# Altium schematic sheet Artix7_SRAM.SchDoc
size A3; SheetNumber: 7; SheetTotal: 14
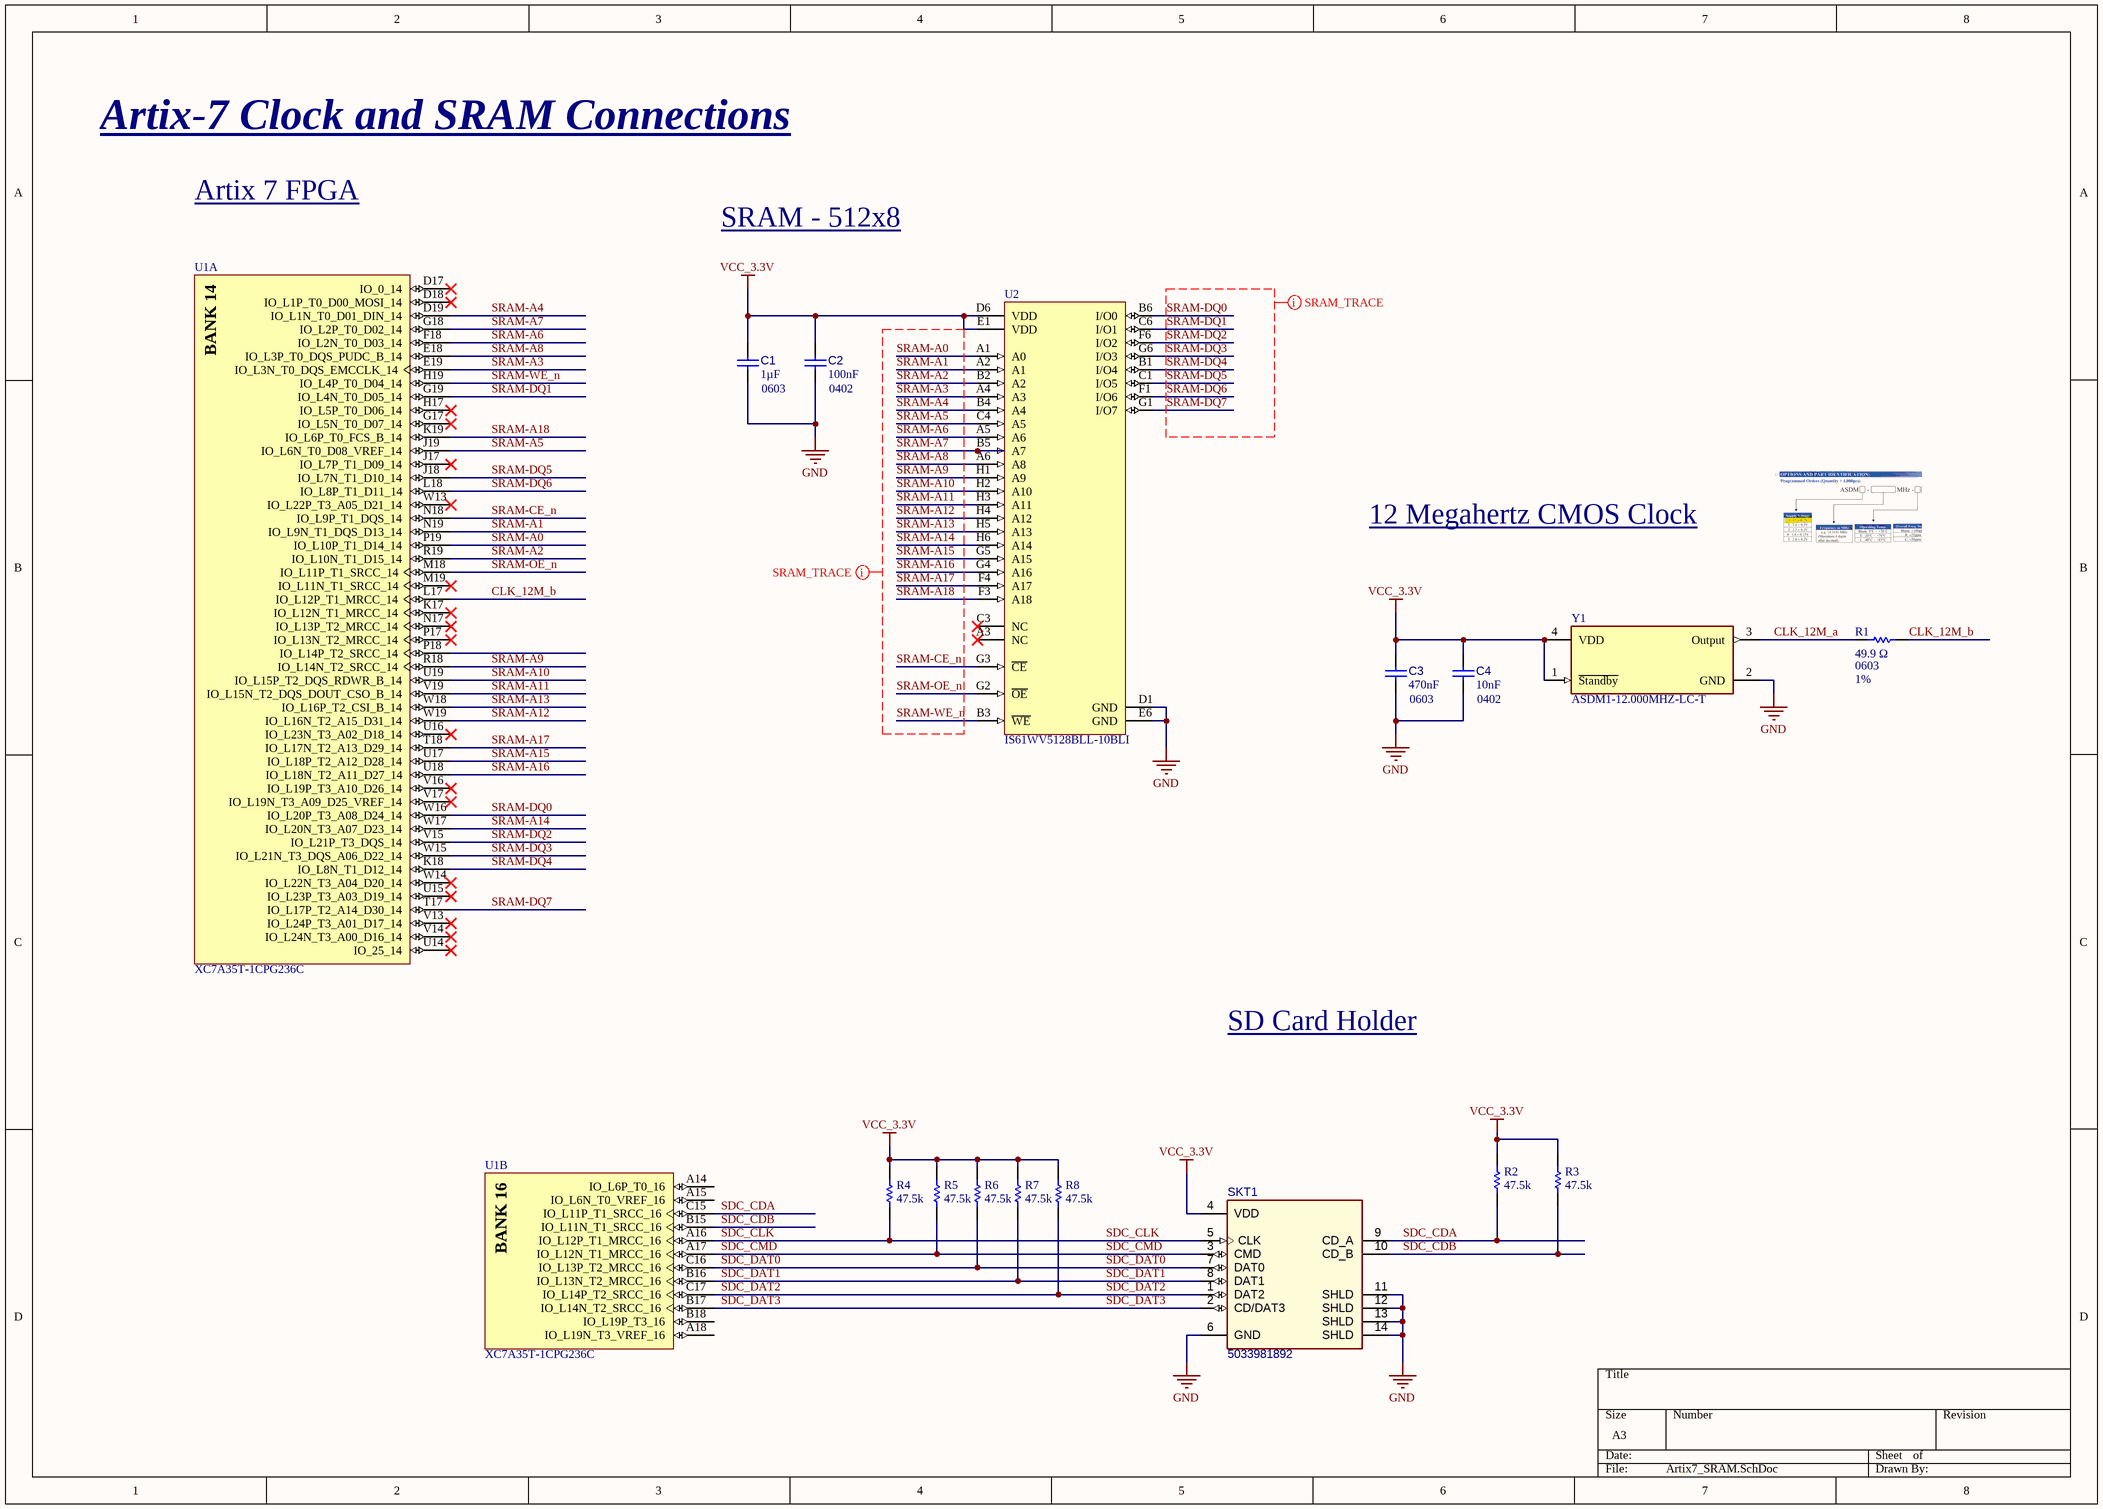
[diagram p0: Artix7_SRAM.SchDoc]

## Parts
C1  value 1µF  Case/Package: 0603  [CAPC0603(1608)100_L]  (hidden comment: Capacitor 1µF +/-0.1% 25V 0603)
C2  value 100nF  Case/Package: 0402  [CAPC0402(1005)60_L]  (hidden comment: Capacitor 100nF +/-20% 25V 0402)
C3  value 470nF  Case/Package: 0603  [CAPC0603(1608)100_L]  (hidden comment: Capacitor 470nF +/-20% 25V 0603)
C4  value 10nF  Case/Package: 0402  [CAPC0402(1005)60_L]  (hidden comment: Capacitor 10nF +/-20% 50V 0402)
R1  value 49.9 Ω  PackageReference: 0603  Tolerance: 1%  [RESC1608X55X25NL10T15]  (hidden comment: RC0603FR-0749R9L)
R2  value 47.5k  [RESC0402(1005)_L]  (hidden comment: 47D5KR2F)
R3  value 47.5k  [RESC0402(1005)_L]  (hidden comment: 47D5KR2F)
R4  value 47.5k  [RESC0402(1005)_L]  (hidden comment: 47D5KR2F)
R5  value 47.5k  [RESC0402(1005)_L]  (hidden comment: 47D5KR2F)
R6  value 47.5k  [RESC0402(1005)_L]  (hidden comment: 47D5KR2F)
R7  value 47.5k  [RESC0402(1005)_L]  (hidden comment: 47D5KR2F)
R8  value 47.5k  [RESC0402(1005)_L]  (hidden comment: 47D5KR2F)
SKT1  5033981892  [MOLX-5033981892_V]
U1  XC7A35T-1CPG236C  [CPG236]  (parts A,B of 10)
U2  IS61WV5128BLL-10BLI  [FP-IS61WV5128BLL-10BLI-IPC_A]
Y1  ASDM1-12.000MHZ-LC-T  [FP-ASDM-ASDMB-MFG]

## Nets
GND: C1.1 C2.1 C3.1 C4.2 SKT1.6(GND) SKT1.11(SHLD) SKT1.12(SHLD) SKT1.13(SHLD) SKT1.14(SHLD) U2.D1(GND) U2.E6(GND) Y1.2(GND)
VCC_3.3V: C1.2 C2.2 C3.2 C4.1 R2.2 R3.2 R4.2 R5.2 R6.2 R7.2 R8.2 SKT1.4(VDD) U2.D6(VDD) U2.E1(VDD) Y1.1(~{Standby}) Y1.4(VDD)
CLK_12M_a: R1.1 Y1.3(Output)
CLK_12M_b: R1.2 U1.L17(IO_L12P_T1_MRCC_14)
SDC_CDA: R2.1 SKT1.9(CD_A) U1.C15(IO_L11P_T1_SRCC_16)
SDC_CDB: R3.1 SKT1.10(CD_B) U1.B15(IO_L11N_T1_SRCC_16)
SDC_CLK: R4.1 SKT1.5(CLK) U1.A16(IO_L12P_T1_MRCC_16)
SDC_CMD: R5.1 SKT1.3(CMD) U1.A17(IO_L12N_T1_MRCC_16)
SDC_DAT0: R6.1 SKT1.7(DAT0) U1.C16(IO_L13P_T2_MRCC_16)
SDC_DAT1: R7.1 SKT1.8(DAT1) U1.B16(IO_L13N_T2_MRCC_16)
SDC_DAT2: R8.1 SKT1.1(DAT2) U1.C17(IO_L14P_T2_SRCC_16)
SDC_DAT3: SKT1.2(CD/DAT3) U1.B17(IO_L14N_T2_SRCC_16)
SRAM-A0: U1.P19(IO_L10P_T1_D14_14) U2.A1(A0)
SRAM-A1: U1.N19(IO_L9N_T1_DQS_D13_14) U2.A2(A1)
SRAM-A2: U1.R19(IO_L10N_T1_D15_14) U2.B2(A2)
SRAM-A3: U1.E19(IO_L3N_T0_DQS_EMCCLK_14) U2.A4(A3)
SRAM-A4: U1.D19(IO_L1N_T0_D01_DIN_14) U2.B4(A4)
SRAM-A5: U1.J19(IO_L6N_T0_D08_VREF_14) U2.C4(A5)
SRAM-A6: U1.F18(IO_L2N_T0_D03_14) U2.A5(A6)
SRAM-A7: U1.G18(IO_L2P_T0_D02_14) U2.B5(A7)
SRAM-A8: U1.E18(IO_L3P_T0_DQS_PUDC_B_14) U2.A6(A8)
SRAM-A9: U1.R18(IO_L14N_T2_SRCC_14) U2.H1(A9)
SRAM-A10: U1.U19(IO_L15P_T2_DQS_RDWR_B_14) U2.H2(A10)
SRAM-A11: U1.V19(IO_L15N_T2_DQS_DOUT_CSO_B_14) U2.H3(A11)
SRAM-A12: U1.W19(IO_L16N_T2_A15_D31_14) U2.H4(A12)
SRAM-A13: U1.W18(IO_L16P_T2_CSI_B_14) U2.H5(A13)
SRAM-A14: U1.W17(IO_L20N_T3_A07_D23_14) U2.H6(A14)
SRAM-A15: U1.U17(IO_L18P_T2_A12_D28_14) U2.G5(A15)
SRAM-A16: U1.U18(IO_L18N_T2_A11_D27_14) U2.G4(A16)
SRAM-A17: U1.T18(IO_L17N_T2_A13_D29_14) U2.F4(A17)
SRAM-A18: U1.K19(IO_L6P_T0_FCS_B_14) U2.F3(A18)
SRAM-CE_n: U1.N18(IO_L9P_T1_DQS_14) U2.G3(~{CE})
SRAM-DQ0: U1.W16(IO_L20P_T3_A08_D24_14) U2.B6(I/O0)
SRAM-DQ1: U1.G19(IO_L4N_T0_D05_14) U2.C6(I/O1)
SRAM-DQ2: U1.V15(IO_L21P_T3_DQS_14) U2.F6(I/O2)
SRAM-DQ3: U1.W15(IO_L21N_T3_DQS_A06_D22_14) U2.G6(I/O3)
SRAM-DQ4: U1.K18(IO_L8N_T1_D12_14) U2.B1(I/O4)
SRAM-DQ5: U1.J18(IO_L7N_T1_D10_14) U2.C1(I/O5)
SRAM-DQ6: U1.L18(IO_L8P_T1_D11_14) U2.F1(I/O6)
SRAM-DQ7: U1.T17(IO_L17P_T2_A14_D30_14) U2.G1(I/O7)
SRAM-OE_n: U1.M18(IO_L11P_T1_SRCC_14) U2.G2(~{OE})
SRAM-WE_n: U1.H19(IO_L4P_T0_D04_14) U2.B3(~{WE})

Not connected (* = marked no-connect by the designer): U1 A14(IO_L6P_T0_16) A15(IO_L6N_T0_VREF_16) A18(IO_L19N_T3_VREF_16) B18(IO_L19P_T3_16) D17(IO_0_14)* D18(IO_L1P_T0_D00_MOSI_14)* G17(IO_L5N_T0_D07_14)* H17(IO_L5P_T0_D06_14)* J17(IO_L7P_T1_D09_14)* K17(IO_L12N_T1_MRCC_14)* M19(IO_L11N_T1_SRCC_14)* N17(IO_L13P_T2_MRCC_14)* P17(IO_L13N_T2_MRCC_14)* P18(IO_L14P_T2_SRCC_14) U14(IO_25_14)* U15(IO_L23P_T3_A03_D19_14)* U16(IO_L23N_T3_A02_D18_14)* V13(IO_L24P_T3_A01_D17_14)* V14(IO_L24N_T3_A00_D16_14)* V16(IO_L19P_T3_A10_D26_14)* V17(IO_L19N_T3_A09_D25_VREF_14)* W13(IO_L22P_T3_A05_D21_14)* W14(IO_L22N_T3_A04_D20_14)*; U2 A3(NC)* C3(NC)*

## Layout directives
net class SRAM_NET_CLASS; rule Fanout Control [Style - BGA    Direction - Alternating In and Out Via Grid = 1mil]; rule Matched Net Lengths [Delay Tolerance = 100ps]: SRAM-DQ0, SRAM-DQ1, SRAM-DQ2, SRAM-DQ3, SRAM-DQ4, SRAM-DQ5, SRAM-DQ6, SRAM-DQ7
net class SRAM_NET_CLASS: SRAM-A0, SRAM-A1, SRAM-A2, SRAM-A3, SRAM-A4, SRAM-A5, SRAM-A6, SRAM-A7, SRAM-A8, SRAM-A9, SRAM-A10, SRAM-A11, SRAM-A12, SRAM-A13, SRAM-A14, SRAM-A15, SRAM-A16, SRAM-A17, SRAM-A18, SRAM-CE_n, SRAM-OE_n, SRAM-WE_n

## Notes on the sheet
- Artix-7 Clock and SRAM Connections
- Artix 7 FPGA
- SRAM - 512x8
- 12 Megahertz CMOS Clock
- SD Card Holder
- (in symbol CMP-0383-00006-1, part A) BANK 14
- (in symbol CMP-0383-00006-1, part B) BANK 16

## Library data of the parts
C1 = CMP-001-00055-5: Chip Capacitor, 1µF +/-0.1%, 25V, 0603, Thickness 1 mm; Tolerance: 20%; Min Operating Temperature: -55°C; Voltage Rating: 25V; Pins: 2; Mounting Technology: SMT; Max Operating Temperature: 85°C
C2 = CMP-001-00065-5: Chip Capacitor, 100nF +/-20%, 25V, 0402, Thickness 0.6 mm; Tolerance: 10%; Voltage Rating: 25V; Min Operating Temperature: -55°C; Mounting Technology: SMT; Pins: 2; Max Operating Temperature: 85°C
C3 = CMP-001-00077-4: Chip Capacitor, 470nF +/-20%, 25V, 0603, Thickness 1 mm; Tolerance: 10%; Pins: 2; Mounting Technology: SMT; Voltage Rating: 25V; Max Operating Temperature: 85°C; Min Operating Temperature: -55°C
C4 = CMP-001-00069-4: Chip Capacitor, 10nF +/-20%, 50V, 0402, Thickness 0.6 mm; Tolerance: 5%; Pins: 2; Mounting Technology: SMT; Max Operating Temperature: 85°C; Voltage Rating: 50V; Min Operating Temperature: -55°C
R1 = CMP-1659-00036-1: General Purpose Chip Resistor, 49.9 Ohm, +/- 1%, -55 to 155 degC, 0603 (1608 Metric), RoHS, Tape and Reel; Max Supply Voltage: 3.63 V; Case\Package: LQFP; Interface: SPI; Min Supply Voltage: 2.97 V; Packaging: Tray; ComponentLink2Description: Datasheet; ComponentLink1Description: Manufacturer URL; ComponentLink2URL: https://datasheet.ciiva.com/11808/0900766b80f96399-11808223.pdf; RoHSCompliant: true; Max Operating Temperature: 85 degC; ComponentLink1URL: http://www.yageo.com/; PackageDescription: 2-Pin Surface Mount Device, Body 1.6 x 0.8 mm; DatasheetVersion: Rev. 4, 04/2009; Min Operating Temperature: -40 degC; Package Quantity: 250; Pins: 48
R2-R8 = CMP-009-00103-4: 47K5 0.063W 1% 0402 (1005 Metric)  SMD; Power: 63mW; Pins: 2; Tolerance: 1%; Mounting Technology: SMT; Case/Package: 0402
SKT1 = CMP-002-00049-3: Micro SD Card Connector, Pitch 1.1 mm, 8 Position, Height 1.4 mm, -25 to 85 degC, RoHS, Tape and Reel; Pins: 14
U1 = CMP-0383-00006-1: Artix-7 FPGA, 106 User I/Os, 2 GTP, 238-Ball BGA, Speed Grade 1, Commercial Grade, Pb-Free; Manufacturer: Xilinx; CMTs: 5; Total Block RAM: 1800 Kb; Logic Cells: 33280; Speed Grades: 1; GTP: 2; Available User I/O: 106; ComponentLink1URL: http://www.xilinx.com/; Maximum Distributed RAM: 400 Kb; PackageVersion: Rev. 1.11; PartNumber: XC7A35T-1CPG236C; ComponentLink2URL: http://www.xilinx.com/support/documentation/data_sheets/ds180_7Series_Overview.pdf; DatasheetVersion: Rev. 1.15; ComponentLink1Description: Manufacturer URL; ComponentLink3Description: Pinout; ComponentLink4Description: Package Specification; Mounting Technology: Surface Mount; PackageReference: CPG-236; Operating Temperature Range: Commercial; PackageDescription: 238-Ball Wire-Bond Chip-Scale BGA, Body 10 x10 mm, Pitch 0.5 mm; ComponentLink3URL: http://www.xilinx.com/support/documentation/user_guides/ug475_7Series_Pkg_Pinout.pdf; ComponentLink4URL: http://www.xilinx.com/support/documentation/user_guides/ug475_7Series_Pkg_Pinout.pdf; ComponentLink2Description: Datasheet
U2 = CMP-0513-00068-2: NexarPartId: 11886108; Density: 4Mb; Min Supply Voltage: 2.4V; Memory Type: SRAM; Number of Words: 512000; Nominal Supply Current: 40mA; Access Time: 10ns; Interface: Parallel; Memory Size: 512kB; Number of Ports: 1; Word Size: 8b; Sync/Async: Asynchronous; Address Bus Width: 19b; Max Supply Voltage: 3.6V; Number of Pins: 36; RoHS: Compliant; Min Operating Temperature: -40°C; Height: 1.2mm; Case/Package: BGA; Max Operating Temperature: 85°C; Ambient Temperature Range High: 85°C; Schedule B: 8542320040, 8542320040; Radiation Hardening: No
Y1 = CMP-27762-002611-1: MEMS Oscillator 12MHz ±50ppm LVCMOS 3.3V SMD 2.5x2mm; Load Capacitance: 15pF; Min Supply Voltage: 3V; Max Supply Voltage: 3.6V; Max Supply Current: 10mA; Length: 0.098inch; Operating Supply Voltage: 3.3V; Number of Pins: 4; Packaging: Tape and Reel; Height: 0.035inch; Width: 0.079inch; Mount: Surface Mount; Case/Package: SMD/SMT; Series: Pure Silicon™ ASDM; Lead Free: Lead Free; Frequency: 12MHz; Max Operating Temperature: 85°C; RoHS Compliant: Yes; Package Quantity: 1000; Min Operating Temperature: -40°C; Operating Frequency: 12 MHz; Termination: SMD/SMT; Frequency Stability: 50ppm